# Altium schematic sheet Buck5.SchDoc
size A4
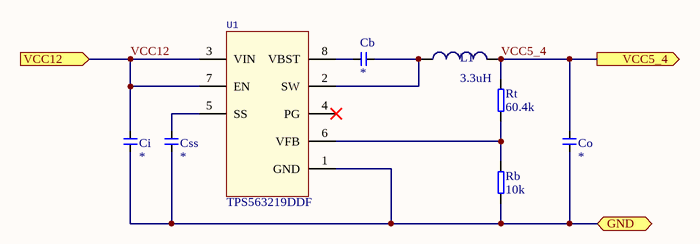
[diagram p0: Buck5.SchDoc]

## Parts
Cb  *  [CAP 0603/1608]
Ci  *  [CAP 0603/1608]
Co  *  [CAP 0603/1608]
Css  *  [CAP 0603/1608]
L1  3.3uH  [INDUCTOR PCC-M0530M3R3KVP]
Rb  10k  [RES 0603/1608]
Rt  60.4k  [RES 0603/1608]
U1  TPS563219DDF  [TSOP65P280X110-8N]

## Ports
GND (bidir), VCC5_4 (out), VCC12 (in)

## Nets
GND: Ci.2 Co.2 Css.2 Rb.1 U1.1(GND) ; port GND
VCC5_4: Co.1 L1.2 Rt.2 ; port VCC5_4
VCC12: Ci.1 U1.3(VIN) U1.7(EN) ; port VCC12
NetCb_1: Cb.1 L1.1 U1.2(SW)
NetCb_2: Cb.2 U1.8(VBST)
NetCss_1: Css.1 U1.5(SS)
NetRb_2: Rb.2 Rt.1 U1.6(VFB)

Not connected (* = marked no-connect by the designer): U1 4(PG)*

## Library data of the parts
Cb Ci Co Css = CAP: Capacitor; Note: *; Desc: *; Value: *
L1 = Inductor: Code_IEC: 1005; Published: 8-Jun-2000; LatestRevisionDate: 29-May-2009; LatestRevisionNote: IPC-7351 Footprint Added.; PackageReference: 0402-A; Publisher: Altium Limited; PackageDescription: Chip Inductor; Code_JEITA: 0402; Value: 3.3uH
Rb Rt = RES: Resistor; Note: *; Desc: *
  Rb: Value: 10k
  Rt: Value: 60.4k